# EAGLE design L298 Motor Driver final (EAGLE 8.2.0)

## Sheet 1 of 2
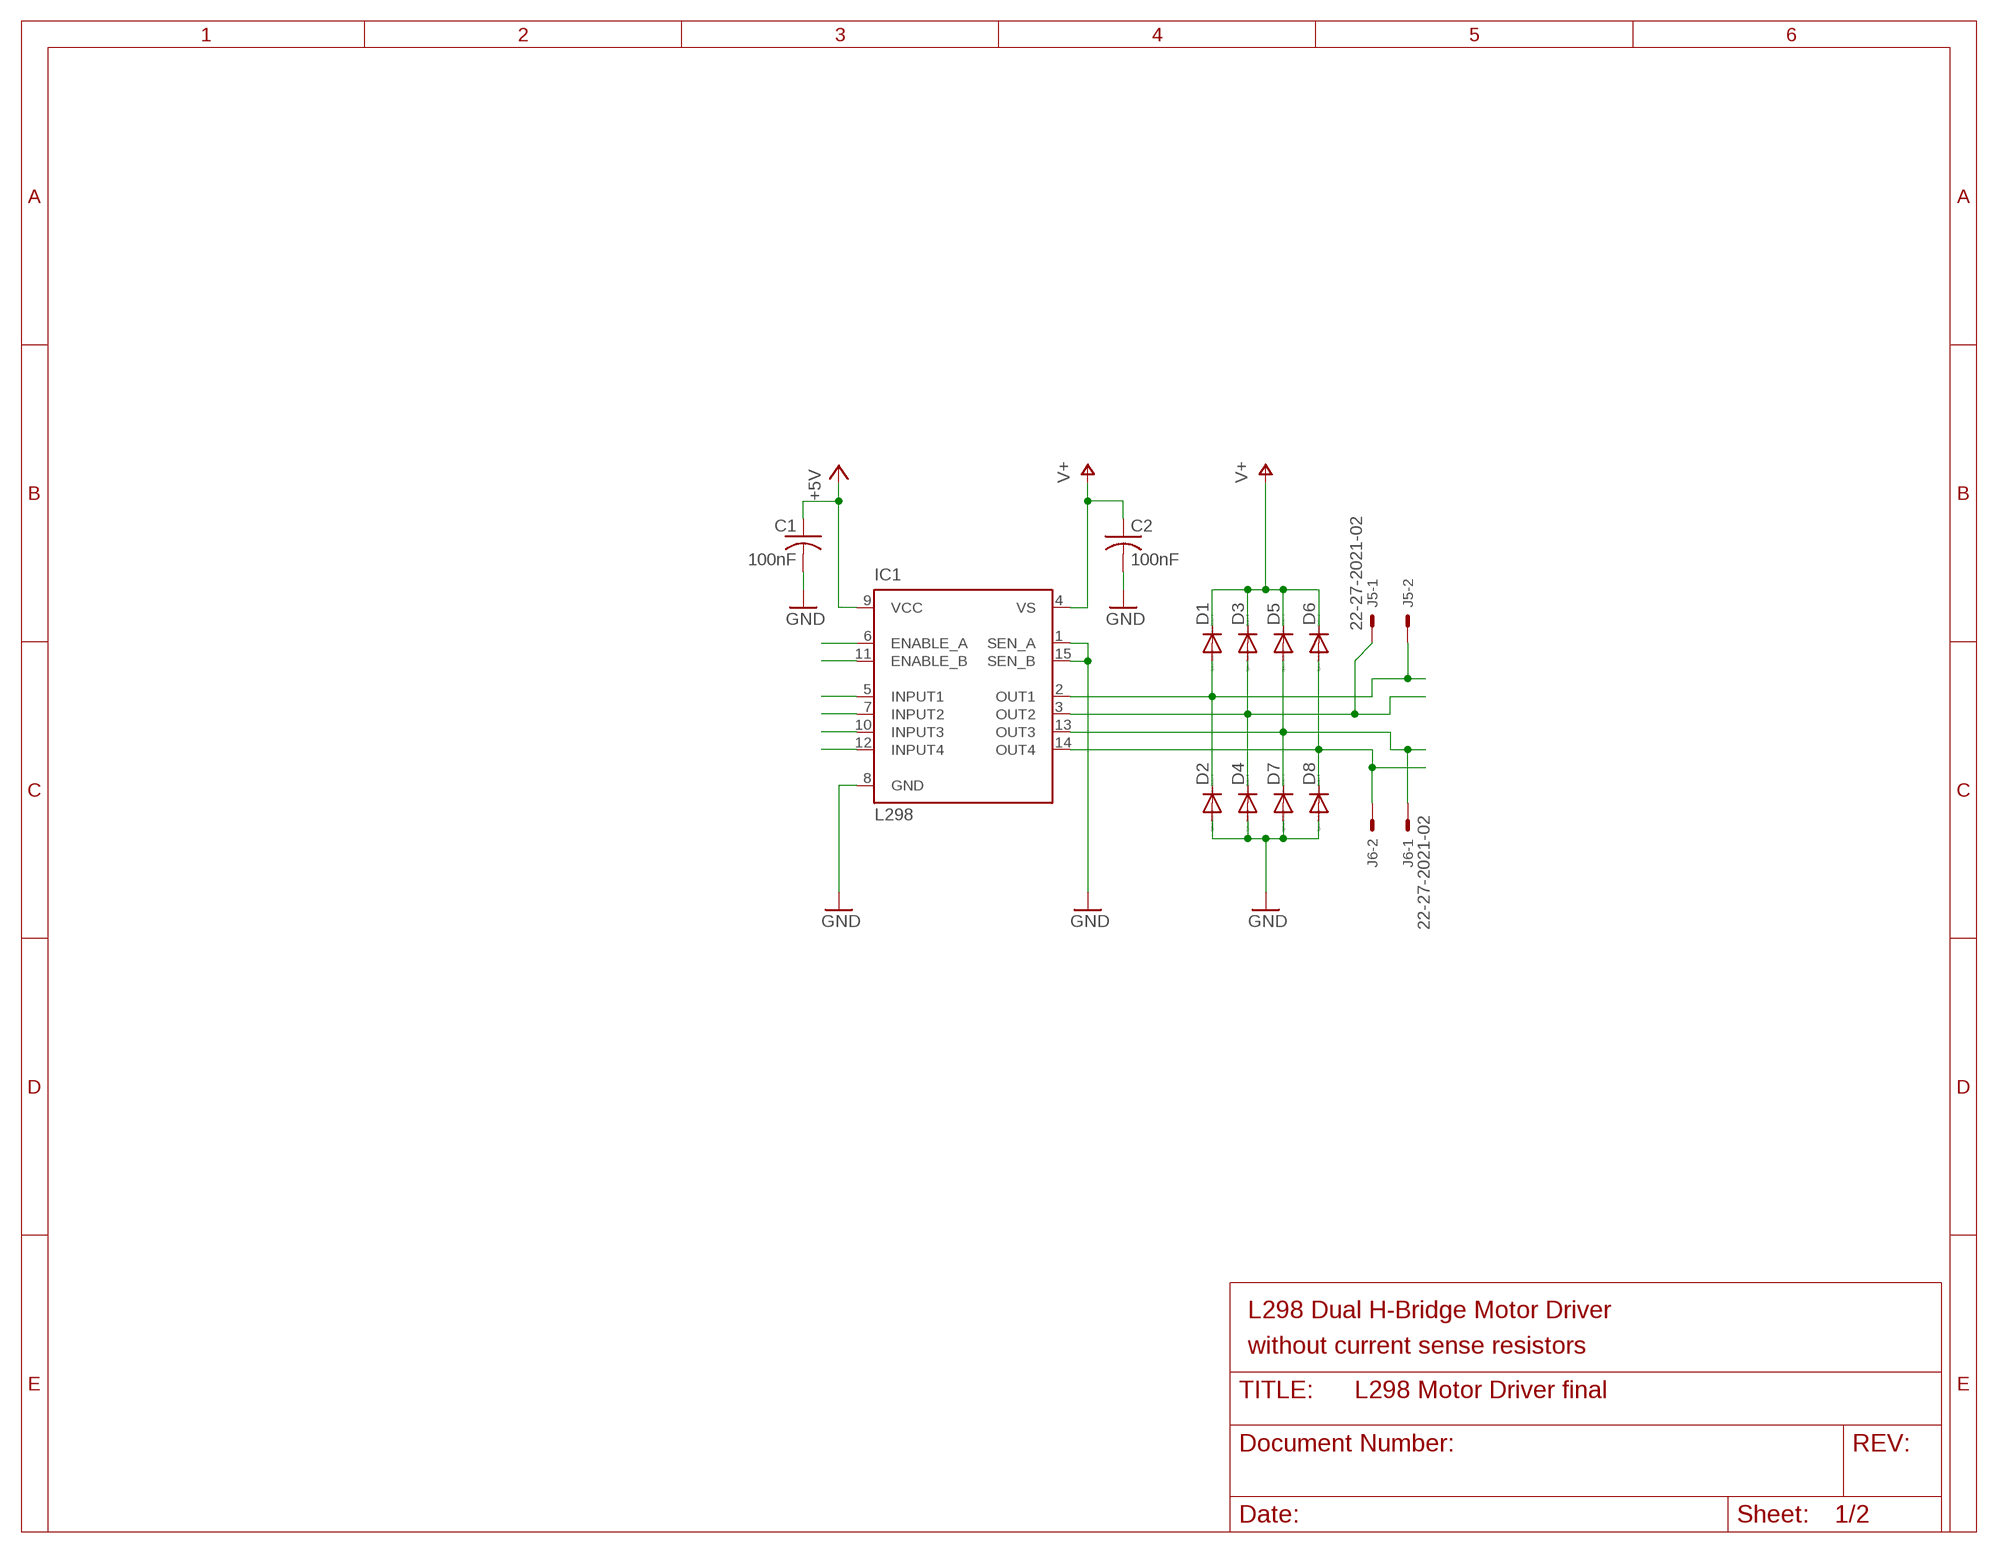
[diagram p0: schematic, sheet 1]

### Parts
C1  100nF  C-US050-024X044  [C050-024X044]
C2  100nF  C-US050-024X044  [C050-024X044]
D1  DIODE-D-5  [D-5]
D2  DIODE-D-5  [D-5]
D3  DIODE-D-5  [D-5]
D4  DIODE-D-5  [D-5]
D5  DIODE-D-5  [D-5]
D6  DIODE-D-5  [D-5]
D7  DIODE-D-5  [D-5]
D8  DIODE-D-5  [D-5]
IC1  L298  [MULTIWATT-15]
J5  22-27-2021-02  [6410-02]
J6  22-27-2021-02  [6410-02]

### Nets
+5V: C1.1 IC1.9(VCC) ; also sheet 2
GND: C1.2 C2.2 D2.A D4.A D7.A D8.A IC1.1(SEN_A) IC1.8(GND) IC1.15(SEN_B) ; also sheet 2
GPIO12: IC1.6(ENABLE_A) ; also sheet 2
GPIO16: IC1.11(ENABLE_B) ; also sheet 2
GPIO19: IC1.12(INPUT4) ; also sheet 2
GPIO20: IC1.5(INPUT1) ; also sheet 2
GPIO21: IC1.7(INPUT2) ; also sheet 2
GPIO26: IC1.10(INPUT3) ; also sheet 2
N$1: D1.A D2.C IC1.2(OUT1) J5.2
N$2: D3.A D4.C IC1.3(OUT2) J5.1
N$3: D6.A D8.C IC1.14(OUT4) J6.2
N$4: D5.A D7.C IC1.13(OUT3) J6.1
V+: C2.1 D1.C D3.C D5.C D6.C IC1.4(VS) ; also sheet 2

### Notes on the sheet
- L298 Dual H-Bridge Motor Driver
- without current sense resistors

## Sheet 2 of 2
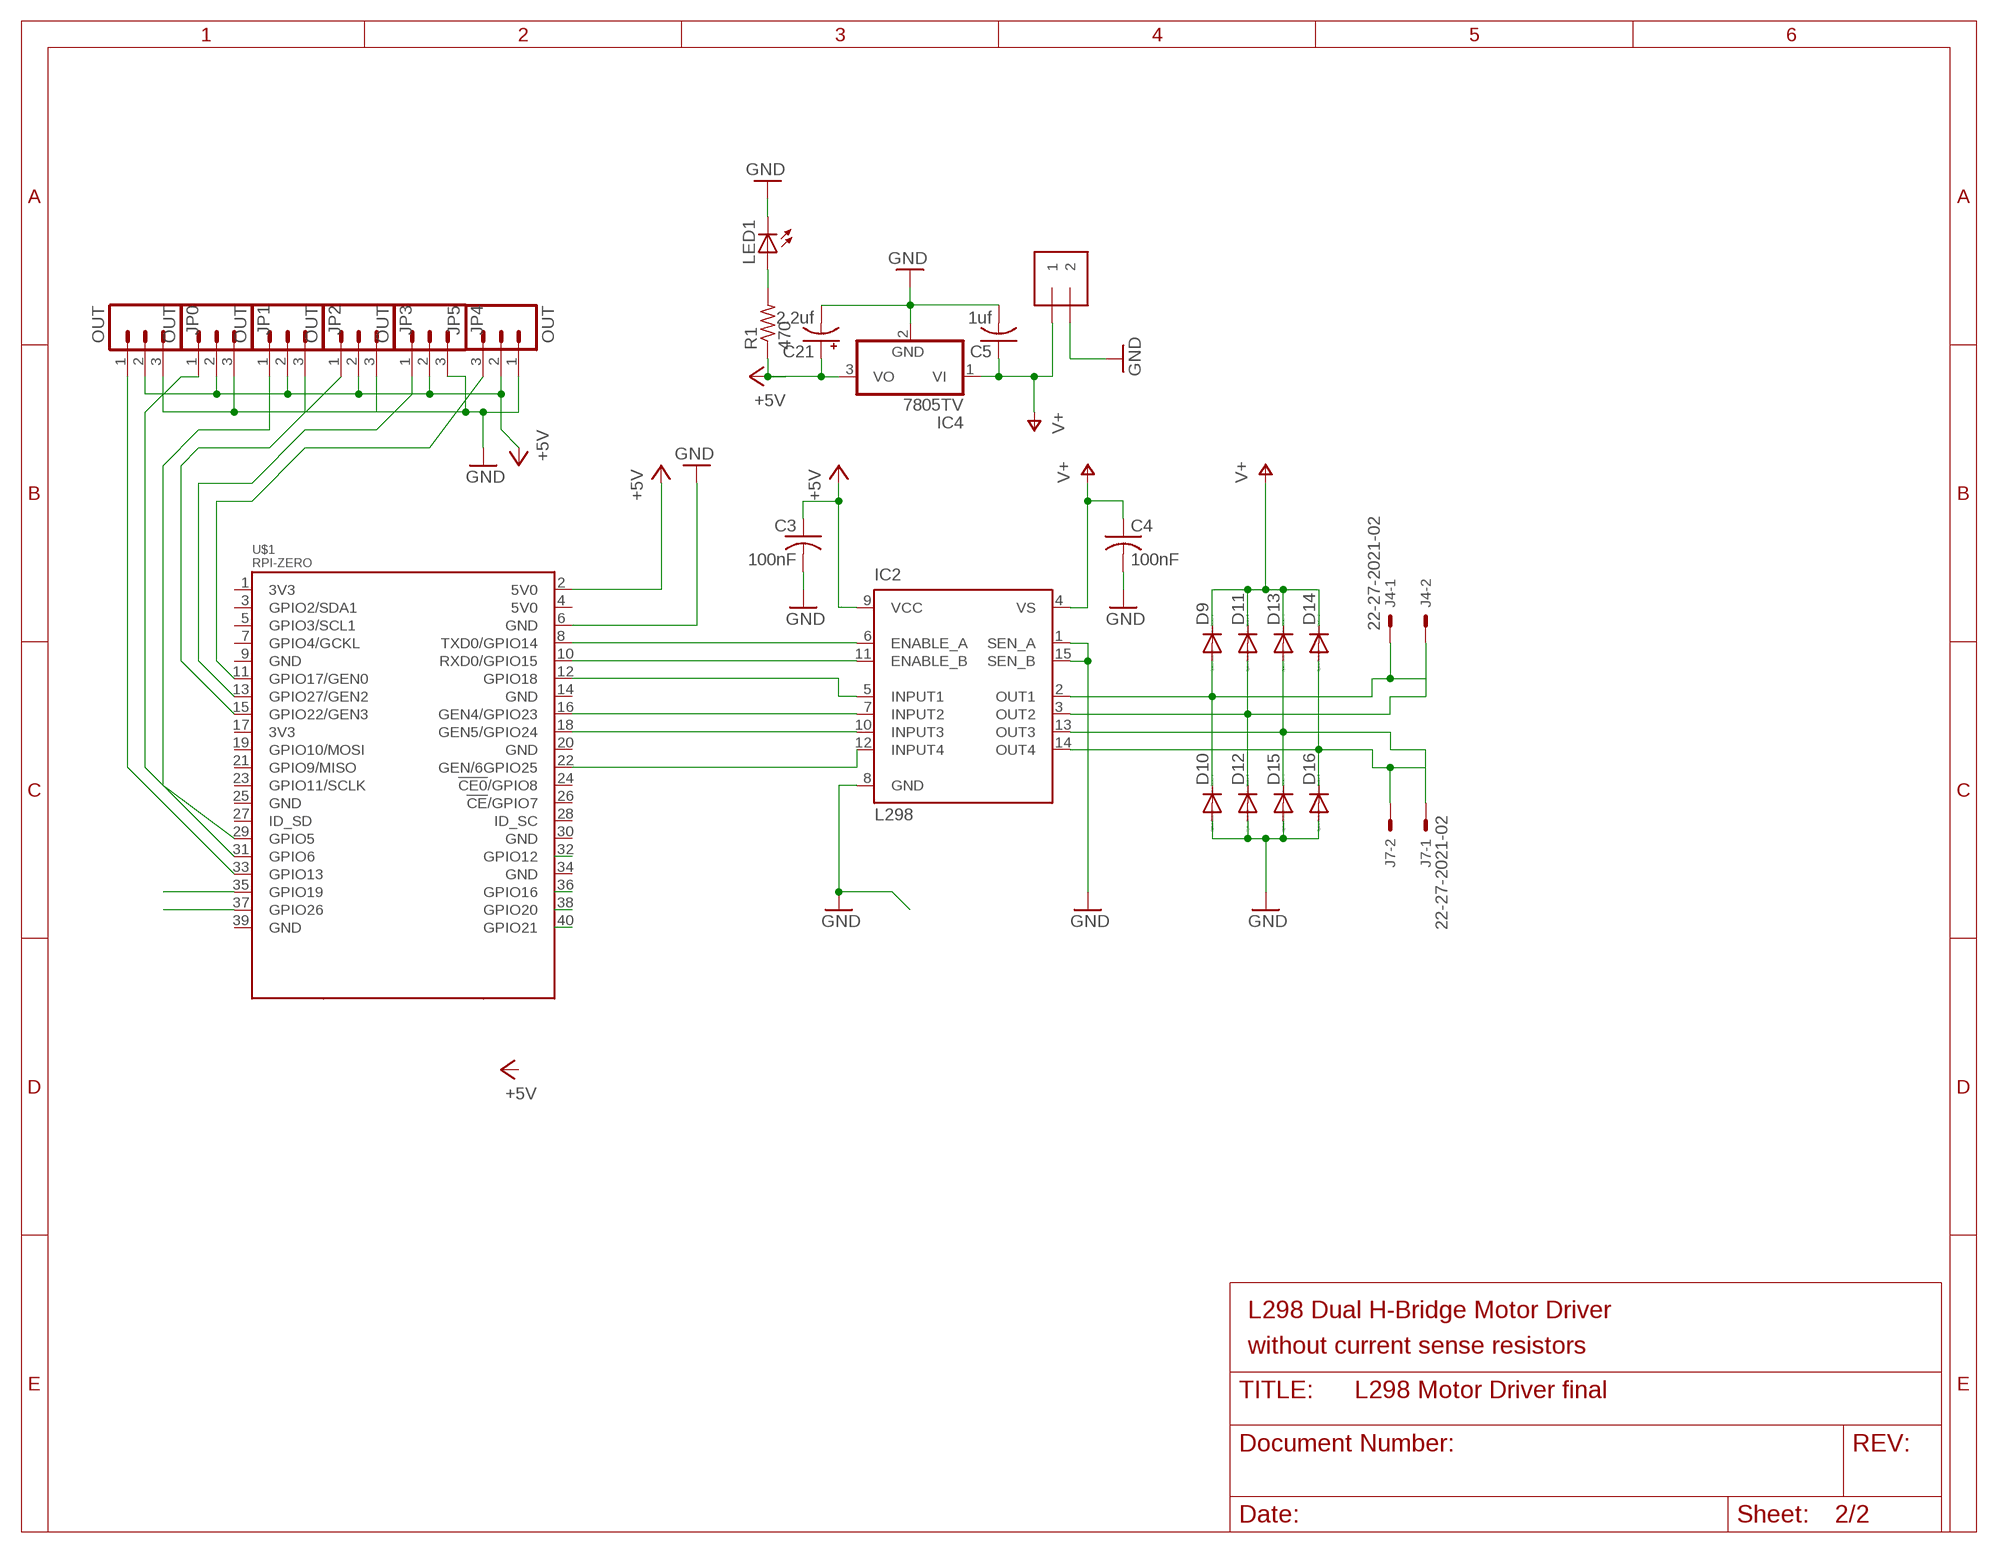
[diagram p1: schematic, sheet 2]

### Parts
C3  100nF  C-US050-024X044  [C050-024X044]
C4  100nF  C-US050-024X044  [C050-024X044]
C5  1uf  C-US050-024X044  [C050-024X044]
C21  2.2uf  CPOL-USE1.8-4  [E1,8-4]
D9  DIODE-D-5  [D-5]
D10  DIODE-D-5  [D-5]
D11  DIODE-D-5  [D-5]
D12  DIODE-D-5  [D-5]
D13  DIODE-D-5  [D-5]
D14  DIODE-D-5  [D-5]
D15  DIODE-D-5  [D-5]
D16  DIODE-D-5  [D-5]
IC2  L298  [MULTIWATT-15]
IC4  7805TV  [TO220V]
J1  1X2-3.5MM  [1X2-3.5MM]
J4  22-27-2021-02  [6410-02]
J7  22-27-2021-02  [6410-02]
JP0  OUT  M03PTH  [1X03]
JP1  OUT  M03PTH  [1X03]
JP2  OUT  M03PTH  [1X03]
JP3  OUT  M03PTH  [1X03]
JP4  OUT  M03PTH  [1X03]
JP5  OUT  M03PTH  [1X03]
LED1  LED5MM  [LED5MM]
R1  470  R-US_0204/7  [0204/7]
U$1  RPI-ZERO  [RASPBERRYPI_BASTELSTUBE_V13_RASPI_BOARD_B+_FULL]

### Nets
+5V: C3.1 C21.+ IC2.9(VCC) IC4.3(VO) JP0.2 JP1.2 JP2.2 JP3.2 JP4.2 JP5.2 R1.1 U$1.2(5V0) ; also sheet 1
GND: C3.2 C4.2 C5.2 C21.- D10.A D12.A D15.A D16.A IC2.1(SEN_A) IC2.8(GND) IC2.15(SEN_B) IC4.2(GND) J1.2 JP0.3 JP1.3 JP2.3 JP3.3 JP4.3 JP5.1 LED1.K(C) U$1.6(GND) ; also sheet 1
GPIO12: U$1.32(GPIO12) ; also sheet 1
GPIO16: U$1.36(GPIO16) ; also sheet 1
GPIO19: U$1.35(GPIO19) ; also sheet 1
GPIO20: U$1.38(GPIO20) ; also sheet 1
GPIO21: U$1.40(GPIO21) ; also sheet 1
GPIO26: U$1.37(GPIO26) ; also sheet 1
N$5: LED1.A R1.2
N$6: JP0.1 U$1.33(GPIO13)
N$7: JP1.1 U$1.31(GPIO6)
N$8: JP2.1 U$1.29(GPIO5)
N$10: JP3.1 U$1.15(GPIO22/GEN3)
N$11: D9.A D10.C IC2.2(OUT1) J4.1
N$12: D11.A D12.C IC2.3(OUT2) J4.2
N$13: D14.A D16.C IC2.14(OUT4) J7.2
N$14: D13.A D15.C IC2.13(OUT3) J7.1
N$15: IC2.6(ENABLE_A) U$1.8(TXD0/GPIO14)
N$16: IC2.11(ENABLE_B) U$1.10(RXD0/GPIO15)
N$17: IC2.5(INPUT1) U$1.12(GPIO18)
N$18: IC2.7(INPUT2) U$1.16(GEN4/GPIO23)
N$19: IC2.10(INPUT3) U$1.18(GEN5/GPIO24)
N$20: IC2.12(INPUT4) U$1.22(GEN/6GPIO25)
N$21: JP4.1 U$1.13(GPIO27/GEN2)
N$22: JP5.3 U$1.11(GPIO17/GEN0)
V+: C4.1 C5.1 D9.C D11.C D13.C D14.C IC2.4(VS) IC4.1(VI) J1.1 ; also sheet 1
Unconnected: U$1.1(3V3) U$1.3(GPIO2/SDA1) U$1.4(5V0) U$1.5(GPIO3/SCL1) U$1.7(GPIO4/GCKL) U$1.9(GND) U$1.14(GND) U$1.17(3V3) U$1.19(GPIO10/MOSI) U$1.20(GND) U$1.21(GPIO9/MISO) U$1.23(GPIO11/SCLK) U$1.24(!CE0!/GPIO8) U$1.25(GND) U$1.26(!CE!/GPIO7) U$1.27(ID_SD) U$1.28(ID_SC) U$1.30(GND) U$1.34(GND) U$1.39(GND)

### Notes on the sheet
- L298 Dual H-Bridge Motor Driver
- without current sense resistors

## Library data of the parts
C1-C5 = rcl:C-US: CAPACITOR, American symbol
C21 = rcl@1:CPOL-US: POLARIZED CAPACITOR, American symbol
D1-D16 = diode:DIODE-: DIODE
IC1 IC2 = st-microelectronics:L298: DUAL FULL-BRIDGE DRIVER; MPN: L298N; OC_FARNELL: 1589425; OC_NEWARK: 32M1527
IC4 = linear:78*: Positive VOLTAGE REGULATOR Source: http://cache.national.com/ds/LM/LM78L05.pdf http://www.fairchildsemi.com/ds/LM/LM7805.pdf
J1 = adafruit:1X2: 3.5mm Terminal block http://www.ladyada.net/library/pcb/eaglelibrary.html
J4-J7 = con-molex:22-?-02: CONNECTOR wire to board 2.54 mm (.1 inch) pitch header; OC_FARNELL: unknown; OC_NEWARK: unknown
JP0 JP1-JP5 = SparkFun:M03: Header 3 Standard 3-pin 0.1" header. Use with straight break away headers (SKU : PRT-00116), right angle break away headers (PRT-00553), swiss pins (PRT-00743), machine pins (PRT-00117), and female headers (PRT-00115). Molex polarized connector foot print use with SKU : PRT-08232 with associated crimp pins and housings.
LED1 = led:LED: LED OSRAM: - CHIPLED LG R971, LG N971, LY N971, LG Q971, LY Q971, LO R971, LY R971 LH N974, LH R974 LS Q976, LO Q976, LY Q976 LO Q996 - Hyper CHIPLED LW Q18S LB Q993, LB Q99A, LB R99A - SideLED LS A670, LO A670, LY A670, LG A670, LP A670 LB A673, LV A673, LT A673, LW A673 LH A674 LY A675 LS A676, LA A676, LO A676, LY A676, LW A676 LS A679, LY A679, LG A679 - Hyper Micro SIDELED® LS Y876, LA Y876, LO Y876, LY Y876 LT Y87S - SmartLED LW L88C, LW L88S LB L89C, LB L89S, LG L890 LS L89K, LO L89K, LY L89K LS L896, LA L896, LO L896, LY L896 - TOPLED LS T670, LO T670, LY T670, LG T670, LP T670 LSG T670, LSP T670, LSY T670, LOP T670, LYG T670 LG T671, LOG T671, LSG T671 LB T673, LV T673, LT T673, LW T673 LH T674 LS T676, LA T676, LO T676, LY T676, LB T676, LH T676, LSB T676, LW T676 LB T67C, LV T67C, LT T67C, LS T67K, LO T67K, LY T67K, LW E67C LS E67B, LA E67B, LO E67B, LY E67B, LB E67C, LV E67C, LT E67C LW T67C LS T679, LY T679, LG T679 LS T770, LO T770, LY T770, LG T770, LP T770 LB T773, LV T773, LT T773, LW T773 LH T774 LS E675, LA E675, LY E675, LS T675 LS T776, LA T776, LO T776, LY T776, LB T776 LHGB T686 LT T68C, LB T68C - Hyper Mini TOPLED® LB M676 - Mini TOPLED Santana® LG M470 LS M47K, LO M47K, LY M47K Source: http://www.osram.convergy.de LUXEON: - LUMILED® LXK2-PW12-R00, LXK2-PW12-S00, LXK2-PW14-U00, LXK2-PW14-V00 LXK2-PM12-R00, LXK2-PM12-S00, LXK2-PM14-U00 LXK2-PE12-Q00, LXK2-PE12-R00, LXK2-PE12-S00, LXK2-PE14-T00, LXK2-PE14-U00 LXK2-PB12-K00, LXK2-PB12-L00, LXK2-PB12-M00, LXK2-PB14-N00, LXK2-PB14-P00, LXK2-PB14-Q00 LXK2-PR12-L00, LXK2-PR12-M00, LXK2-PR14-Q00, LXK2-PR14-R00 LXK2-PD12-Q00, LXK2-PD12-R00, LXK2-PD12-S00 LXK2-PH12-R00, LXK2-PH12-S00 LXK2-PL12-P00, LXK2-PL12-Q00, LXK2-PL12-R00 Source: www.luxeon.com KINGBRIGHT: KA-3528ASYC Source: www.kingbright.com
R1 = resistor:R-US_: RESISTOR, American symbol
U$1 = RPI-Zero:RPI-ZERO

## Net classes
0 default: clearance 0.205 mm

## Board
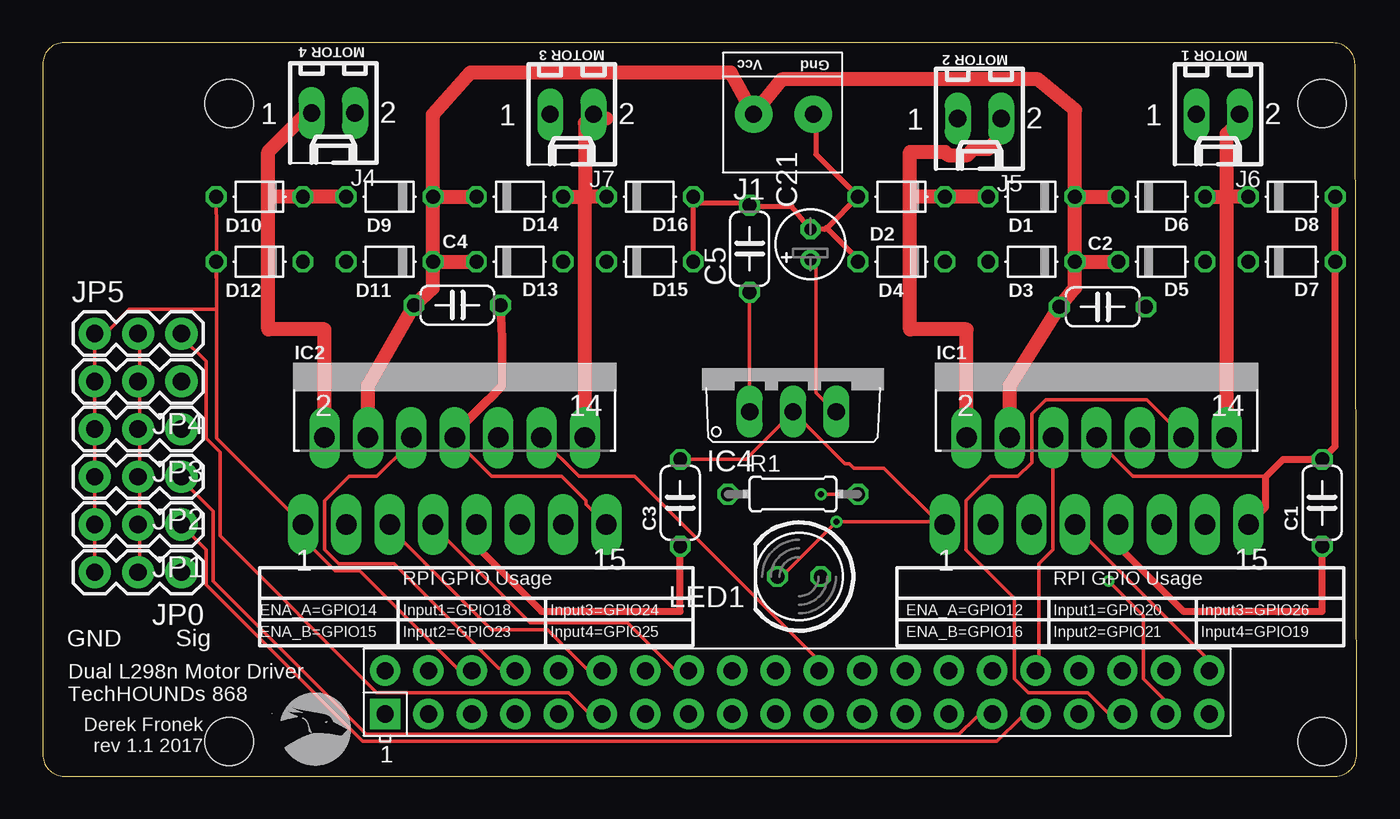
[diagram p2: board, top side]
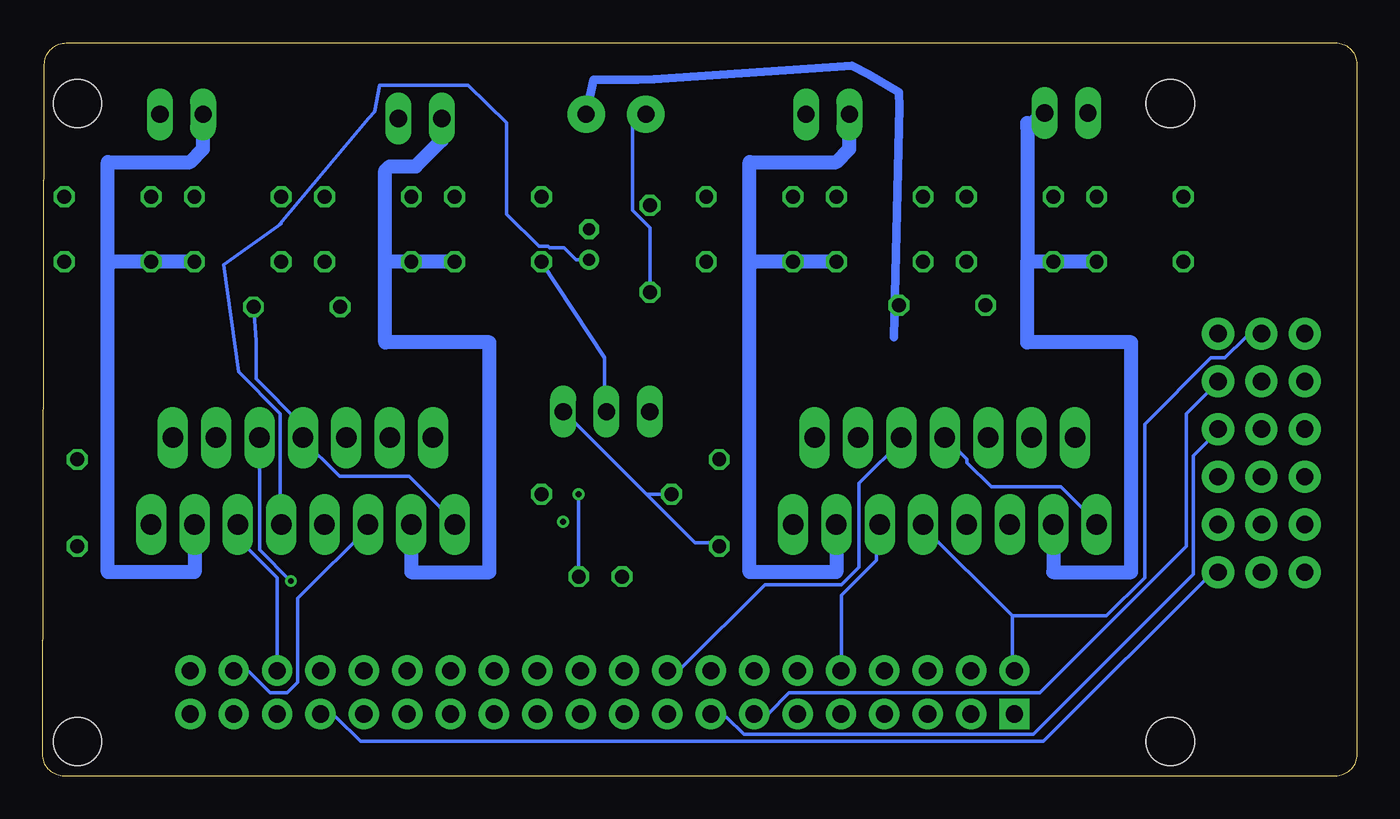
[diagram p3: board, bottom side, seen from below]

Size 76.96 x 42.94 mm. Coordinates in mm from the lower left corner, seen from the top.
Outline: 76.96,1.27 76.86,41.66 arc90 75.59,42.93 1.27,42.94 arc90 0,41.67 0,1.27 arc90 1.27,0 75.69,0 arc90 76.96,1.27
Copper layers (1*16): Top 0.0356mm / dielectric 1.5011mm / Bottom 0.0356mm
Design rules "LaenPCBOrder *": minimum track width 8mil, minimum drill 13mil, track to track 8mil, track to pad 6mil, pad to pad 6mil, via to via 6mil, smd to smd 6mil, copper to edge 15mil, drill to drill 6mil, minimum pad ring 7mil, minimum via ring 7mil, stop-mask expansion 4mil, vias tented up to drill 0mil, thermal gap 10mil
Holes 2.8 mm at 74.93,2.03 74.93,39.37 10.92,2.03 10.92,39.37

### Footprints (pad centres in the part's own frame; a part is rotated, then mirrored left to right if it is on the bottom)
C050-024X044 = drill 0.813 octagon: 1 -2.54,0; 2 2.54,0
E1,8-4 = drill 0.711 pad 1.168: + -0.889,0 | drill 0.711 pad 1.168 octagon: - 0.889,0
D-5 = drill 0.813 octagon: A 2.54,0; C -2.54,0
MULTIWATT-15 = drill 1.2 long: 1 -8.89,-7.62; 2 -7.62,-2.54; 3 -6.35,-7.62; 4 -5.08,-2.54; 5 -3.81,-7.62; 6 -2.54,-2.54; 7 -1.27,-7.62; 8 0,-2.54; 9 1.27,-7.62; 10 2.54,-2.54; 11 3.81,-7.62; 12 5.08,-2.54; 13 6.35,-7.62; 14 7.62,-2.54; 15 8.89,-7.62
TO220V = drill 1.016 long: 1 -2.54,-2.54; 2 0,-2.54; 3 2.54,-2.54
1X2-3.5MM = drill 1 pad 2.184: 1 1.8,0; 2 -1.7,0
6410-02 = drill 1.016 long: 1 1.27,0; 2 -1.27,0
1X03 = drill 1.016 pad 1.88: 1 0,0; 2 2.54,0; 3 5.08,0
LED5MM = drill 0.813 octagon: A -1.27,0; K 1.27,0
0204/7 = drill 0.813 octagon: 1 -3.81,0; 2 3.81,0
RASPBERRYPI_BASTELSTUBE_V13_RASPI_BOARD_B+_FULL = drill 1 pad 1.778 square: 1 8.37,25.23 | drill 1 pad 1.778: 2 8.37,27.77; 3 10.91,25.23; 4 10.91,27.77; 5 13.45,25.23; 6 13.45,27.77; 7 15.99,25.23; 8 15.99,27.77; 9 18.53,25.23; 10 18.53,27.77; 11 21.07,25.23; 12 21.07,27.77; 13 23.61,25.23; 14 23.61,27.77; 15 26.15,25.23; 16 26.15,27.77; 17 28.69,25.23; 18 28.69,27.77; 19 31.23,25.23; 20 31.23,27.77; 21 33.77,25.23; 22 33.77,27.77; 23 36.31,25.23; 24 36.31,27.77; 25 38.85,25.23; 26 38.85,27.77; 27 41.39,25.23; 28 41.39,27.77; 29 43.93,25.23; 30 43.93,27.77; 31 46.47,25.23; 32 46.47,27.77; 33 49.01,25.23; 34 49.01,27.77; 35 51.55,25.23; 36 51.55,27.77; 37 54.09,25.23; 38 54.09,27.77; 39 56.63,25.23; 40 56.63,27.77

### Placement (x,y rotation side)
C1  74.93,16 90 top
C2  62.08,27.47 0 top
C3  37.34,16 90 top
C4  24.28,27.57 0 top
C5  41.4,30.87 90 top
C21  44.96,31.13 90 top
D1  57.91,33.92 180 top
D2  50.29,33.92 180 top
D3  57.91,30.11 180 top
D4  50.29,30.11 180 top
D5  65.53,30.11 0 top
D6  65.53,33.92 0 top
D7  73.15,30.11 0 top
D8  73.15,33.92 0 top
D9  20.32,33.92 180 top
D10  12.7,33.92 180 top
D11  20.32,30.11 180 top
D12  12.7,30.11 180 top
D13  27.94,30.11 0 top
D14  27.94,33.92 0 top
D15  35.56,30.11 0 top
D16  35.56,33.92 0 top
IC1  61.72,22.35 0 top
IC2  24.13,22.35 0 top
IC4  43.94,23.88 0 top
J1  43.43,38.75 180 top
J4  17.02,38.82 180 top
J5  54.86,38.49 180 top
J6  68.83,38.75 180 top
J7  30.99,38.75 180 top
JP0  8.13,11.94 180 top
JP1  8.13,14.73 180 top
JP2  8.13,17.53 180 top
JP3  8.13,20.32 180 top
JP4  8.13,23.11 180 top
JP5  3.05,25.91 0 top
LED1  44.3,11.68 180 top
R1  43.94,16.51 0 top
U$1  11.68,-21.59 0 top

### Tracks (layer width: path | path; a pad name or v marks a point on that pad's centre or on a via)
+5V
  Top 0.203: C21.+ 45.28,30.07 45.28,22.44 46.3,21.42 IC4.3 | JP0.2 5.69,12.03 5.69,14.69 JP1.2 5.69,14.89 5.69,17.34 JP2.2 5.69,17.54 5.69,20.2 JP3.2 5.69,20.4 5.69,23.05 JP4.2 5.69,23.26 5.69,25.71 JP5.2
  Top 0.406: IC1.9 62.99,13.46 66.8,9.65 74.93,9.65 C1.1 | IC2.9 25.4,13.46 29.21,9.65 37.34,9.65 C3.1
  Bottom 0.203: 20.18,9.38 20.18,6.32 U$1.2 | 20.18,9.38 25.49,14.69 IC2.9 | 41.6,16.51 38.75,13.67 37.53,13.67 C3.1 | 41.6,16.51 46.3,21.22 IC4.3 | IC1.9 63.04,14.89 63.04,21.22 65.49,23.67 66.35,29.95 62.98,32.33 63.08,32.31 57.88,38.5 57.52,38.9 57.24,40.46 52.04,40.44 49.78,38.24 49.78,32.91 47.91,31.03 47.37,31.03 47.28,30.93 46.41,30.93 45.72,30.24 C21.+ 45.28,30.28 | 41.6,16.51 R1.1 | 20.18,9.38 14.67,9.38 12.42,11.62 12.42,20.6 8.55,24.48 7.73,24.48 6.51,25.71 5.69,25.71 JP5.2
GND  (via drill 0.35)
  Top 0.203: 26.92,22.85 24.06,19.99 IC2.8 24.06,19.79 26.3,17.54 30.39,17.54 31.81,16.11 31.81,15.91 32.83,14.89 IC2.15 | D10.A 10.18,31.83 10.18,28.36 D12.A 10.18,28.16 10.18,27.34 | U$1.6 25.08,6.32 24.26,6.32 18.55,12.03 17.12,12.03 15.28,13.87 15.28,14.69 IC2.1 15.08,14.89 10.18,19.79 10.18,27.34 | 71.63,17.53 71.61,17.54 63.86,17.54 61.61,19.79 IC1.8 | C3.2 37.53,18.56 41.2,18.56 43.86,21.22 IC4.2 | 38.14,33.54 38.14,33.75 D16.A 38.14,33.54 | 38.14,33.54 38.14,30.28 D15.A | 47.73,33.95 D2.A | 41.41,33.34 C5.2 | IC1.1 52.63,14.89 52.42,14.89 | 44.31,21.22 IC4.2 | 52.42,14.89 v46.49,14.89 43.28,11.68 LED1.K | IC4.2 46.99,18.29 47.24,18.29 47.5,18.03 49.28,18.03 52.42,14.89 | JP0.3 3.04,12.03 3.04,14.69 JP1.3 3.04,14.89 3.04,17.34 JP2.3 3.04,17.54 3.04,20.2 JP3.3 3.04,20.4 3.04,23.05 JP4.3 3.04,23.26 3.04,25.71 JP5.1 3.24,25.91 3.65,25.91 5.08,27.34 10.18,27.34
  Top 0.305: J1.2 45.28,38.6 45.28,36.4 47.73,33.95 | D2.A 45.95,32.12 45.9,32.12 | 45.9,32.12 45.8,32.02 C21.- 43.89,33.34 41.41,33.34 | 45.9,32.12 47.75,30.26 D4.A | C5.2 41.27,33.54 38.14,33.54 | D16.A D15.A
  Top 0.406: D8.A D7.A 75.69,19.3 C1.2 72.64,18.54 71.63,17.53 71.63,15.75 IC1.15
  Top 0.508: C4.2 26.92,25.65 26.92,22.85 26.14,22.07 26.11,22.07 24.06,20.02 24.06,19.99 24.06,19.79
  Bottom 0.203: IC2.8 24.06,19.79 22.83,18.56 22.83,18.36 21.4,16.93 17.32,16.93 15.28,14.89 IC2.1 | C2.2 64.47,25.5 64.47,23.26 61.82,20.6 61.82,19.99 IC1.8 61.82,19.79 59.57,17.54 55.49,17.54 52.84,14.89 IC1.1 | IC4.2 44.06,21.42 44.06,24.48 47.73,30.07 D4.A | 27.12,25.71 C4.2 | 37.94,33.95 D16.A
  Bottom 0.508: J1.2 44.7,40.78 42.11,40.78 41.15,40.8 29.57,41.59 28.59,41.1 26.82,40.03 26.79,39.17 27.12,25.71
GPIO12
  Top 0.203: U$1.32 58.35,6.32 58.35,12.44 59.16,13.26 59.16,19.79 IC1.6
GPIO16
  Bottom 0.203: U$1.36 63.25,6.32 63.25,11.62 65.49,13.87 65.49,14.69 IC1.11
GPIO19
  Top 0.203: U$1.35 63.04,3.66 62.43,3.66 61.2,4.89 57.73,4.89 56.92,5.71 56.92,10.4 54.06,13.26 54.06,16.11 55.49,17.54 57.12,17.54 57.94,18.36 57.94,21.22 58.75,22.03 64.67,22.03 66.71,19.99 IC1.12
GPIO20
  Bottom 0.203: U$1.38 65.69,6.11 64.88,6.11 63.65,4.89 62.63,4.89 62.02,5.5 62.02,10.4 57.73,14.69 IC1.5
GPIO21
  Top 0.203: U$1.40 68.14,6.32 68.14,6.93 60.39,14.69 IC1.7
GPIO26  (via drill 0.33)
  Top 0.203: v62.43,11.42 64.47,9.38 64.47,5.71 65.69,4.48 65.69,3.66 U$1.37
  Bottom 0.203: v62.43,11.42 64.27,13.26 64.27,19.79 IC1.10
N$1
  Top 0.813: 50.8,33.92 50.8,36.54 52.84,36.54 53.03,36.36 54.16,36.36 54.52,36.72 55.37,36.72 56.13,37.48 J5.2 | D1.A D2.C 50.8,33.92 | IC1.2 54.1,26.16 50.8,26.16 50.8,33.92
N$2
  Bottom 0.813: IC1.3 55.37,11.94 50.8,11.94 50.8,25.4 56.9,25.4 56.9,30.11 | D4.C D3.A 56.9,30.11 | 56.9,30.11 56.9,35.45 56.64,35.7 55.12,35.7 53.59,37.22 J5.1
N$3
  Top 0.813: IC1.14 69.34,33.92 | 69.34,33.92 69.34,37.59 70.1,38.35 J6.2 | D6.A 69.34,33.92 | D8.C 69.34,33.92
N$4
  Bottom 0.813: IC1.13 68.07,11.94 73.15,11.94 73.15,29.86 | 73.15,29.86 73.15,35.95 68.33,35.95 67.56,36.72 J6.1 | D5.A D7.C 72.9,30.11 73.15,29.86
N$5  (via drill 0.35)
  Top 0.203: v45.57,16.51 R1.2
  Bottom 0.203: LED1.A v45.57,16.51
N$6
  Bottom 0.203: U$1.33 60.59,3.46 59.78,3.46 58.35,2.03 18.34,2.03 8.55,11.83 8.14,11.83 JP0.1
N$7
  Top 0.203: U$1.31 58.14,3.46 57.33,3.46 55.9,2.03 18.75,2.03 9.57,11.22 9.57,13.26 8.14,14.69 JP1.1
N$8
  Top 0.203: U$1.29 55.49,3.46 54.67,3.46 53.65,2.44 18.96,2.44 9.98,11.42 9.98,15.5 8.14,17.34 JP2.1
N$10
  Bottom 0.203: U$1.15 37.73,3.46 36.92,3.46 35.9,2.44 18.96,2.44 9.57,11.83 9.57,18.77 8.14,20.2 JP3.1
N$11
  Top 0.813: 13.21,33.92 13.21,36.54 15.67,39 J4.1 | D9.A D10.C 13.21,33.92 | IC2.2 16.51,26.16 13.21,26.16 13.21,33.92
N$12
  Bottom 0.813: IC2.3 17.78,11.94 13.21,11.94 13.21,25.4 19.3,25.4 19.3,30.11 | 19.3,37.99 19.3,30.11 | 19.3,37.99 19.3,38.25 | D12.C D11.A 19.3,30.11 | 18.29,38.49 J4.2 19.3,37.99
N$13
  Top 0.813: IC2.14 31.75,33.92 | 31.75,33.92 31.75,38.24 J7.2 32.51,38.49 33.02,38.49 | D14.A 31.75,33.92 | D16.C 31.75,33.92
N$14
  Bottom 0.813: IC2.13 30.48,11.94 35.56,11.94 35.56,29.86 | 35.56,29.86 35.56,35.95 30.48,35.95 29.72,36.72 J7.1 | D13.A D15.C 35.31,30.11 35.56,29.86
N$15
  Top 0.203: U$1.8 27.53,6.32 26.71,6.32 20.59,12.44 17.32,12.44 16.51,13.26 16.51,16.11 17.93,17.54 19.57,17.54 21.4,19.38 21.4,19.79 IC2.6
N$16
  Bottom 0.203: U$1.10 30.18,6.32 30.18,10.6 28.14,12.65 28.14,14.69 IC2.11
N$17
  Top 0.203: U$1.12 32.63,6.32 31.81,6.32 29.57,8.56 26.3,8.56 20.18,14.69 IC2.5
N$18
  Top 0.203: U$1.16 37.73,6.32 36.92,6.32 34.26,8.97 28.55,8.97 22.83,14.69 IC2.7
N$19
  Bottom 0.203: U$1.18 40.18,6.32 39.57,6.32 34.67,11.22 30.18,11.22 29.16,12.24 29.16,17.14 26.51,19.79 IC2.10
N$20
  Top 0.203: U$1.22 45.28,6.32 45.28,6.93 34.67,17.54 31.41,17.54 29.16,19.79 IC2.12
N$21
  Bottom 0.203: U$1.13 35.28,3.66 34.47,3.66 33.24,4.89 18.55,4.89 9.98,13.46 9.98,21.22 8.14,23.05 JP4.1
N$22
  Top 0.203: U$1.11 32.63,3.66 32.02,3.66 30.79,4.89 19.57,4.89 10.38,14.07 10.38,18.97 9.57,19.79 9.57,24.28 8.14,25.71 JP5.3
V+
  Top 0.203: C5.1 41.41,26.32 41.41,21.42 IC4.1
  Top 0.813: IC1.4 56.64,22.86 C2.1 60.45,28.59 D3.C | D3.C D1.C | D1.C D6.C | D3.C D5.C | IC2.4 19.05,22.86 C4.1 22.86,28.59 D11.C | D11.C D9.C | D9.C D14.C | D11.C D13.C | D1.C 60.45,39 58.29,40.79 43.28,40.79 J1.1 40.29,41.2 25.07,41.2 22.86,38.75 D9.C
  Bottom 0.203: C5.1 41.41,28.44 41.41,32.12 42.43,33.14 42.43,38.03 41.81,38.65 J1.1

### Text on the board
tPlace: MOTOR 4 | MOTOR 3 | MOTOR 2 | MOTOR 1 | Vcc | Gnd | C:/Users/Derek Fronek/Downloads/Black Coin.bmp
tNames: RPI GPIO Usage | RPI GPIO Usage | ENA_A=GPIO14 | Input1=GPIO18 | Input3=GPIO24 | ENA_A=GPIO12 | Input1=GPIO20 | Input3=GPIO26 | ENA_B=GPIO15 | Input2=GPIO23 | Input4=GPIO25 | ENA_B=GPIO16 | Input2=GPIO21 | Input4=GPIO19 | GND | Sig | Dual L298n Motor Driver / TechHOUNDs 868 | Derek Fronek / rev 1.1 2017